# EAGLE design temperature_2 (EAGLE 9.6.2)
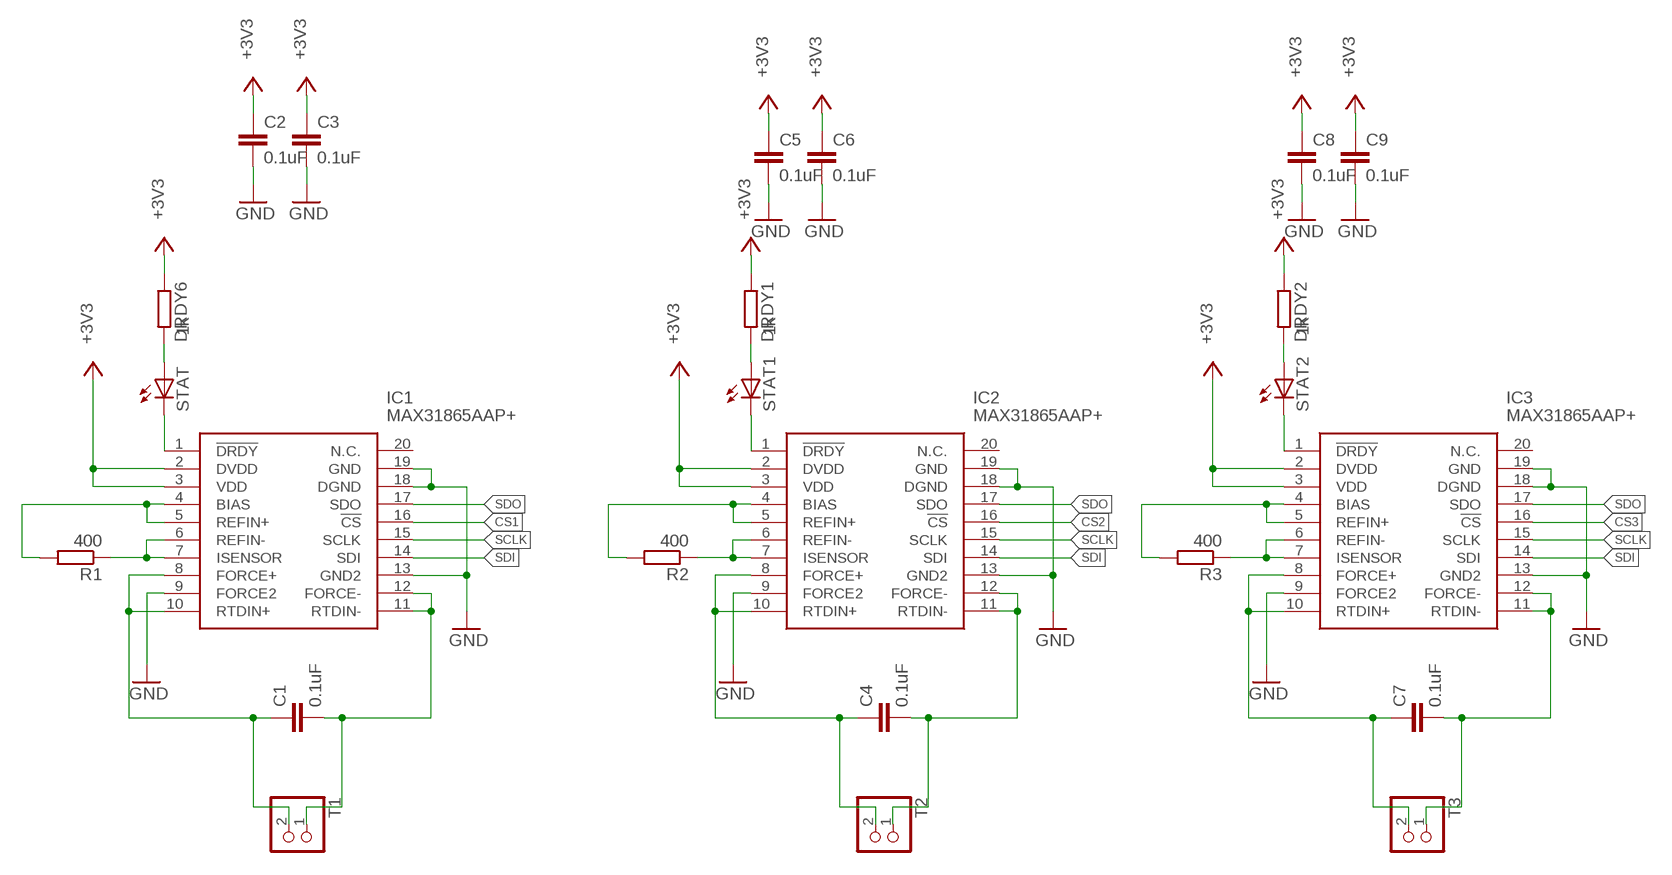
[diagram p0: schematic, sheet 1, part 1 of 2]
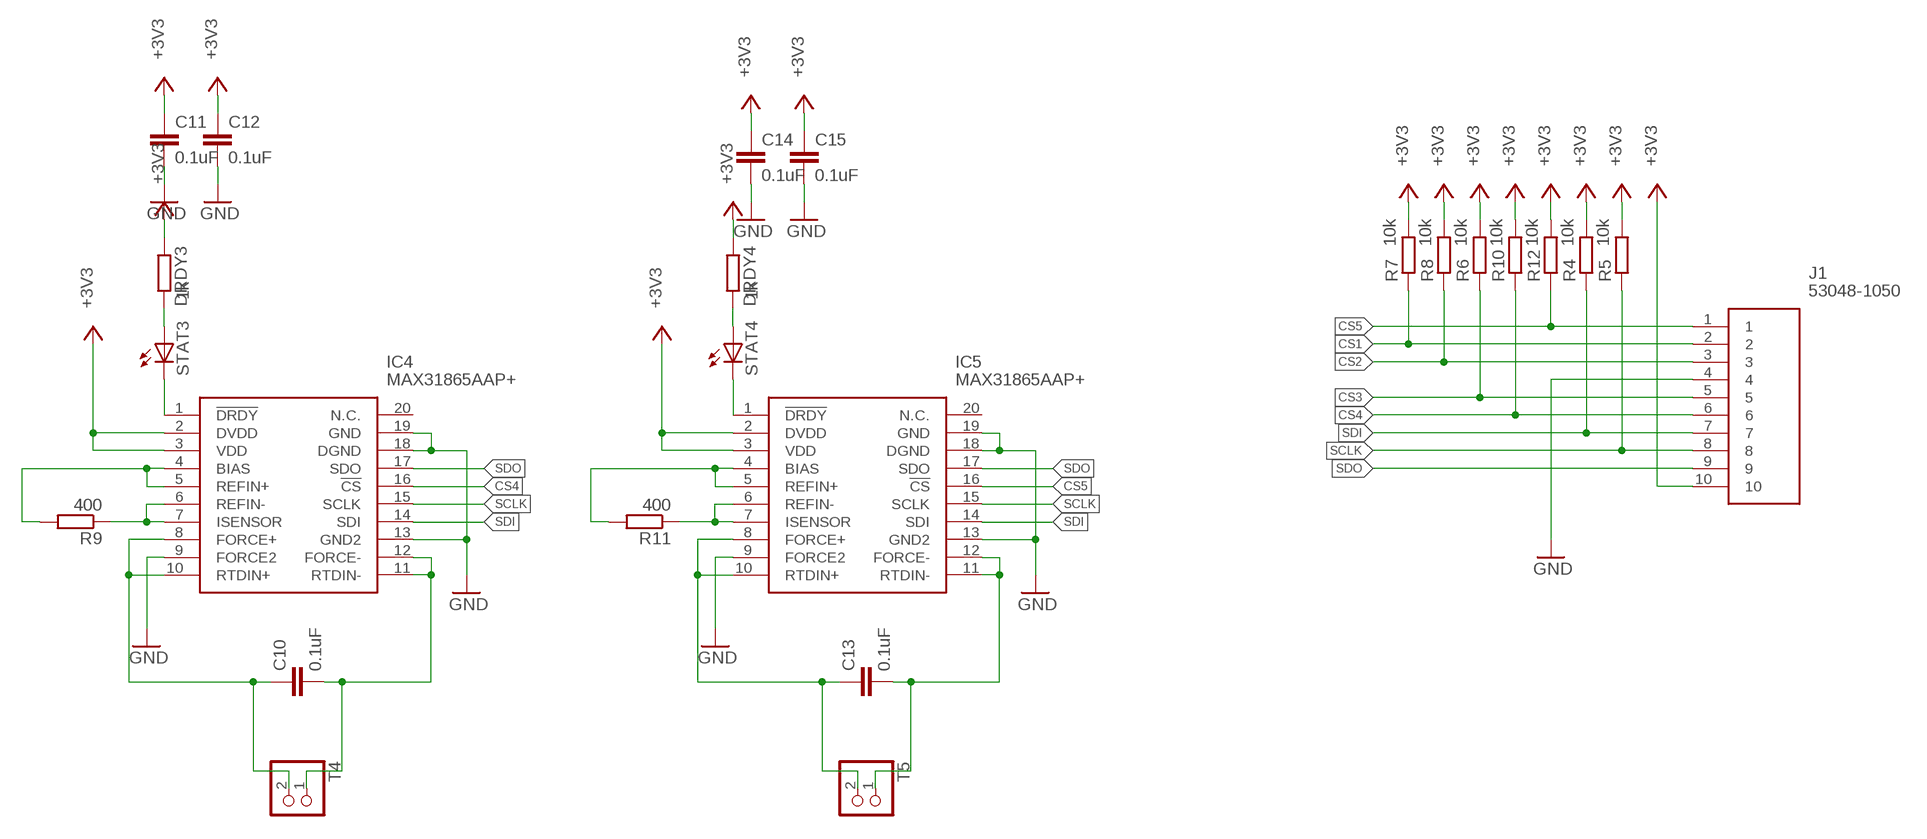
[diagram p1: schematic, sheet 1, part 2 of 2]

## Parts
C1  0.1uF  C-EUC0603K  [C0603K]
C2  0.1uF  C-EUC0603K  [C0603K]
C3  0.1uF  C-EUC0603K  [C0603K]
C4  0.1uF  C-EUC0603K  [C0603K]
C5  0.1uF  C-EUC0603K  [C0603K]
C6  0.1uF  C-EUC0603K  [C0603K]
C7  0.1uF  C-EUC0603K  [C0603K]
C8  0.1uF  C-EUC0603K  [C0603K]
C9  0.1uF  C-EUC0603K  [C0603K]
C10  0.1uF  C-EUC0603K  [C0603K]
C11  0.1uF  C-EUC0603K  [C0603K]
C12  0.1uF  C-EUC0603K  [C0603K]
C13  0.1uF  C-EUC0603K  [C0603K]
C14  0.1uF  C-EUC0603K  [C0603K]
C15  0.1uF  C-EUC0603K  [C0603K]
DRDY1  1k  R-EU_R0603  [R0603]
DRDY2  1k  R-EU_R0603  [R0603]
DRDY3  1k  R-EU_R0603  [R0603]
DRDY4  1k  R-EU_R0603  [R0603]
DRDY6  1k  R-EU_R0603  [R0603]
IC1  MAX31865AAP+  [SOP65P778X199-20N]
IC2  MAX31865AAP+  [SOP65P778X199-20N]
IC3  MAX31865AAP+  [SOP65P778X199-20N]
IC4  MAX31865AAP+  [SOP65P778X199-20N]
IC5  MAX31865AAP+  [SOP65P778X199-20N]
J1  53048-1050  [SHDRRA10W25P0X125_1X10_1425X55]
R1  400  R-EU_R1206  [R1206]
R2  400  R-EU_R1206  [R1206]
R3  400  R-EU_R1206  [R1206]
R4  10k  R-EU_R0603  [R0603]
R5  10k  R-EU_R0603  [R0603]
R6  10k  R-EU_R0603  [R0603]
R7  10k  R-EU_R0603  [R0603]
R8  10k  R-EU_R0603  [R0603]
R9  400  R-EU_R1206  [R1206]
R10  10k  R-EU_R0603  [R0603]
R11  400  R-EU_R1206  [R1206]
R12  10k  R-EU_R0603  [R0603]
STAT  LEDCHIPLED_0805  [CHIPLED_0805]
STAT1  LEDCHIPLED_0805  [CHIPLED_0805]
STAT2  LEDCHIPLED_0805  [CHIPLED_0805]
STAT3  LEDCHIPLED_0805  [CHIPLED_0805]
STAT4  LEDCHIPLED_0805  [CHIPLED_0805]
T1  PINHD-1X2  [1X02]
T2  PINHD-1X2  [1X02]
T3  PINHD-1X2  [1X02]
T4  PINHD-1X2  [1X02]
T5  PINHD-1X2  [1X02]

## Nets
+3V3: C2.1 C3.1 C5.1 C6.1 C8.1 C9.1 C11.1 C12.1 C14.1 C15.1 DRDY1.1 DRDY2.1 DRDY3.1 DRDY4.1 DRDY6.1 IC1.2(DVDD) IC1.3(VDD) IC2.2(DVDD) IC2.3(VDD) IC3.2(DVDD) IC3.3(VDD) IC4.2(DVDD) IC4.3(VDD) IC5.2(DVDD) IC5.3(VDD) J1.10 R4.2 R5.2 R6.2 R7.2 R8.2 R10.2 R12.2
CS1: IC1.16(!CS) J1.2 R7.1
CS2: IC2.16(!CS) J1.3 R8.1
CS3: IC3.16(!CS) J1.5 R6.1
CS4: IC4.16(!CS) J1.6 R10.1
CS5: IC5.16(!CS) J1.1 R12.1
GND: C2.2 C3.2 C5.2 C6.2 C8.2 C9.2 C11.2 C12.2 C14.2 C15.2 IC1.9(FORCE2) IC1.13(GND2) IC1.18(DGND) IC1.19(GND) IC2.9(FORCE2) IC2.13(GND2) IC2.18(DGND) IC2.19(GND) IC3.9(FORCE2) IC3.13(GND2) IC3.18(DGND) IC3.19(GND) IC4.9(FORCE2) IC4.13(GND2) IC4.18(DGND) IC4.19(GND) IC5.9(FORCE2) IC5.13(GND2) IC5.18(DGND) IC5.19(GND) J1.4
N$1: IC2.4(BIAS) IC2.5(REFIN+) R2.2
N$2: IC2.6(REFIN-) IC2.7(ISENSOR) R2.1
N$3: C4.1 IC2.8(FORCE+) IC2.10(RTDIN+) T2.2
N$4: C4.2 IC2.11(RTDIN-) IC2.12(FORCE-) T2.1
N$5: IC3.4(BIAS) IC3.5(REFIN+) R3.2
N$6: IC3.6(REFIN-) IC3.7(ISENSOR) R3.1
N$7: C7.1 IC3.8(FORCE+) IC3.10(RTDIN+) T3.2
N$8: C7.2 IC3.11(RTDIN-) IC3.12(FORCE-) T3.1
N$9: IC4.4(BIAS) IC4.5(REFIN+) R9.2
N$10: IC4.6(REFIN-) IC4.7(ISENSOR) R9.1
N$11: C10.1 IC4.8(FORCE+) IC4.10(RTDIN+) T4.2
N$12: C10.2 IC4.11(RTDIN-) IC4.12(FORCE-) T4.1
N$13: IC5.4(BIAS) IC5.5(REFIN+) R11.2
N$14: IC5.6(REFIN-) IC5.7(ISENSOR) R11.1
N$15: C13.1 IC5.8(FORCE+) IC5.10(RTDIN+) T5.2
N$16: C13.2 IC5.11(RTDIN-) IC5.12(FORCE-) T5.1
N$17: DRDY6.2 STAT.A
N$18: IC1.1(!DRDY) STAT.C
N$19: DRDY1.2 STAT1.A
N$20: IC2.1(!DRDY) STAT1.C
N$21: DRDY2.2 STAT2.A
N$22: IC1.4(BIAS) IC1.5(REFIN+) R1.2
N$23: IC1.6(REFIN-) IC1.7(ISENSOR) R1.1
N$24: IC3.1(!DRDY) STAT2.C
N$25: C1.1 IC1.8(FORCE+) IC1.10(RTDIN+) T1.2
N$26: C1.2 IC1.11(RTDIN-) IC1.12(FORCE-) T1.1
N$27: DRDY3.2 STAT3.A
N$28: IC4.1(!DRDY) STAT3.C
N$29: DRDY4.2 STAT4.A
N$30: IC5.1(!DRDY) STAT4.C
SCLK: IC1.15(SCLK) IC2.15(SCLK) IC3.15(SCLK) IC4.15(SCLK) IC5.15(SCLK) J1.8 R5.1
SDI: IC1.14(SDI) IC2.14(SDI) IC3.14(SDI) IC4.14(SDI) IC5.14(SDI) J1.7 R4.1
SDO: IC1.17(SDO) IC2.17(SDO) IC3.17(SDO) IC4.17(SDO) IC5.17(SDO) J1.9
Unconnected: IC1.20(N.C.) IC2.20(N.C.) IC3.20(N.C.) IC4.20(N.C.) IC5.20(N.C.)

## Library data of the parts
C1-C15 = rcl:C-EU: CAPACITOR, European symbol; SPICEPREFIX: C
DRDY1-DRDY4 DRDY6 R1-R12 = rcl:R-EU_: RESISTOR, European symbol; SPICEPREFIX: R
IC1-IC5 = MAX31865AAP+:MAX31865AAP+: Data Acquisition ADCs/DACs - Specialized RTD to Digital Converter in SSOP Source: Datasheet <https://componentsearchengine.com/Datasheets/1/MAX31865AAP .pdf>; DESCRIPTION: Data Acquisition ADCs/DACs - Specialized RTD to Digital Converter in SSOP; HEIGHT: 1.99mm; MANUFACTURER_NAME: Maxim Integrated; MANUFACTURER_PART_NUMBER: MAX31865AAP+; MOUSER_PART_NUMBER: 700-MAX31865AAP+; MOUSER_PRICE-STOCK: https://www.mouser.com/Search/Refine.aspx?Keyword=700-MAX31865AAP%2B; RS_PART_NUMBER: 1901435; RS_PRICE-STOCK: http://uk.rs-online.com/web/p/products/1901435
J1 = 53048-1050:53048-1050: 1.25mm Pitch, PicoBlade PCB Header, Single Row, Right-Angle, Through Hole, Gold (Au) Plating, Friction Lock, 4 Circuits, Tape and Reel, 2.30mm PC Tail Length Source: Datasheet <https://www.mouser.com/datasheet/2/276/0530481050_PCB_HEADERS-1532231.pdf>; DESCRIPTION: 1.25mm Pitch, PicoBlade PCB Header, Single Row, Right-Angle, Through Hole, Gold (Au) Plating, Friction Lock, 4 Circuits, Tape and Reel, 2.30mm PC Tail Length; HEIGHT: 3.5mm; MANUFACTURER_NAME: Molex; MANUFACTURER_PART_NUMBER: 53048-1050; MOUSER_PART_NUMBER: 538-53048-1050; MOUSER_PRICE-STOCK: https://www.mouser.co.uk/ProductDetail/Molex/53048-1050?qs=0lSvoLzn4L%252B50FRVV9pEsg%3D%3D
STAT STAT1-STAT4 = led:LED: LED OSRAM: - CHIPLED LG R971, LG N971, LY N971, LG Q971, LY Q971, LO R971, LY R971 LH N974, LH R974 LS Q976, LO Q976, LY Q976 LO Q996 - Hyper CHIPLED LW Q18S LB Q993, LB Q99A, LB R99A - SideLED LS A670, LO A670, LY A670, LG A670, LP A670 LB A673, LV A673, LT A673, LW A673 LH A674 LY A675 LS A676, LA A676, LO A676, LY A676, LW A676 LS A679, LY A679, LG A679 - Hyper Micro SIDELED® LS Y876, LA Y876, LO Y876, LY Y876 LT Y87S - SmartLED LW L88C, LW L88S LB L89C, LB L89S, LG L890 LS L89K, LO L89K, LY L89K LS L896, LA L896, LO L896, LY L896 - TOPLED LS T670, LO T670, LY T670, LG T670, LP T670 LSG T670, LSP T670, LSY T670, LOP T670, LYG T670 LG T671, LOG T671, LSG T671 LB T673, LV T673, LT T673, LW T673 LH T674 LS T676, LA T676, LO T676, LY T676, LB T676, LH T676, LSB T676, LW T676 LB T67C, LV T67C, LT T67C, LS T67K, LO T67K, LY T67K, LW E67C LS E67B, LA E67B, LO E67B, LY E67B, LB E67C, LV E67C, LT E67C LW T67C LS T679, LY T679, LG T679 LS T770, LO T770, LY T770, LG T770, LP T770 LB T773, LV T773, LT T773, LW T773 LH T774 LS E675, LA E675, LY E675, LS T675 LS T776, LA T776, LO T776, LY T776, LB T776 LHGB T686 LT T68C, LB T68C - Hyper Mini TOPLED® LB M676 - Mini TOPLED Santana® LG M470 LS M47K, LO M47K, LY M47K Source: http://www.osram.convergy.de LUXEON: - LUMILED® LXK2-PW12-R00, LXK2-PW12-S00, LXK2-PW14-U00, LXK2-PW14-V00 LXK2-PM12-R00, LXK2-PM12-S00, LXK2-PM14-U00 LXK2-PE12-Q00, LXK2-PE12-R00, LXK2-PE12-S00, LXK2-PE14-T00, LXK2-PE14-U00 LXK2-PB12-K00, LXK2-PB12-L00, LXK2-PB12-M00, LXK2-PB14-N00, LXK2-PB14-P00, LXK2-PB14-Q00 LXK2-PR12-L00, LXK2-PR12-M00, LXK2-PR14-Q00, LXK2-PR14-R00 LXK2-PD12-Q00, LXK2-PD12-R00, LXK2-PD12-S00 LXK2-PH12-R00, LXK2-PH12-S00 LXK2-PL12-P00, LXK2-PL12-Q00, LXK2-PL12-R00 Source: www.luxeon.com KINGBRIGHT: KA-3528ASYC Source: www.kingbright.com
T1-T5 = pinhead:PINHD-1X2: PIN HEADER

## Board
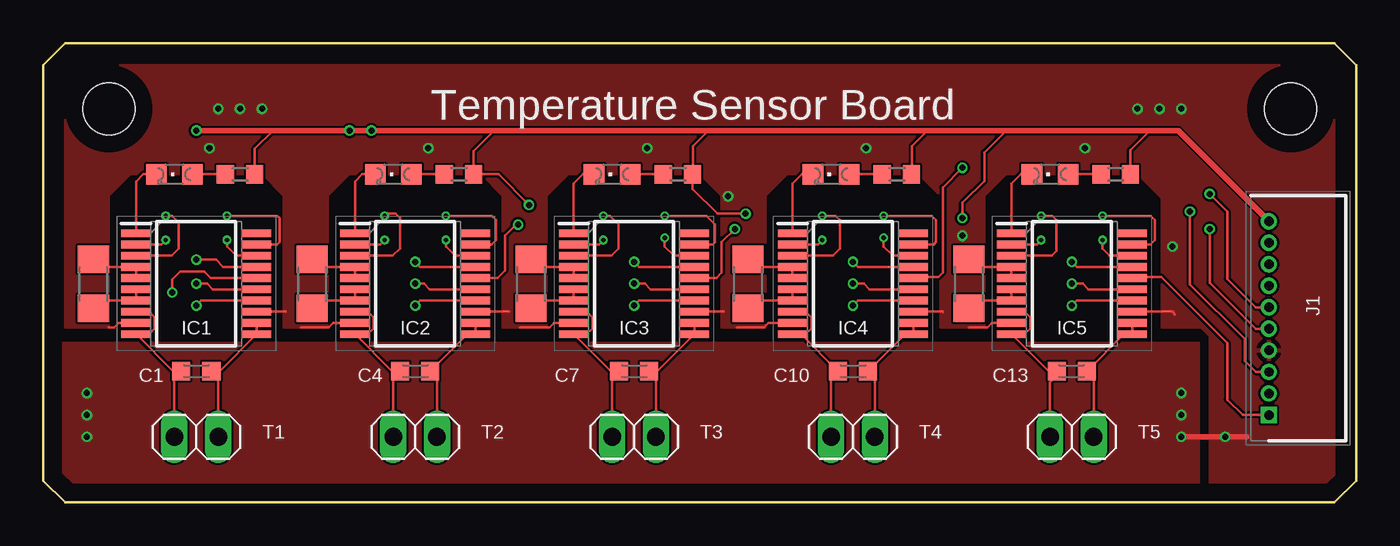
[diagram p2: board, top side]
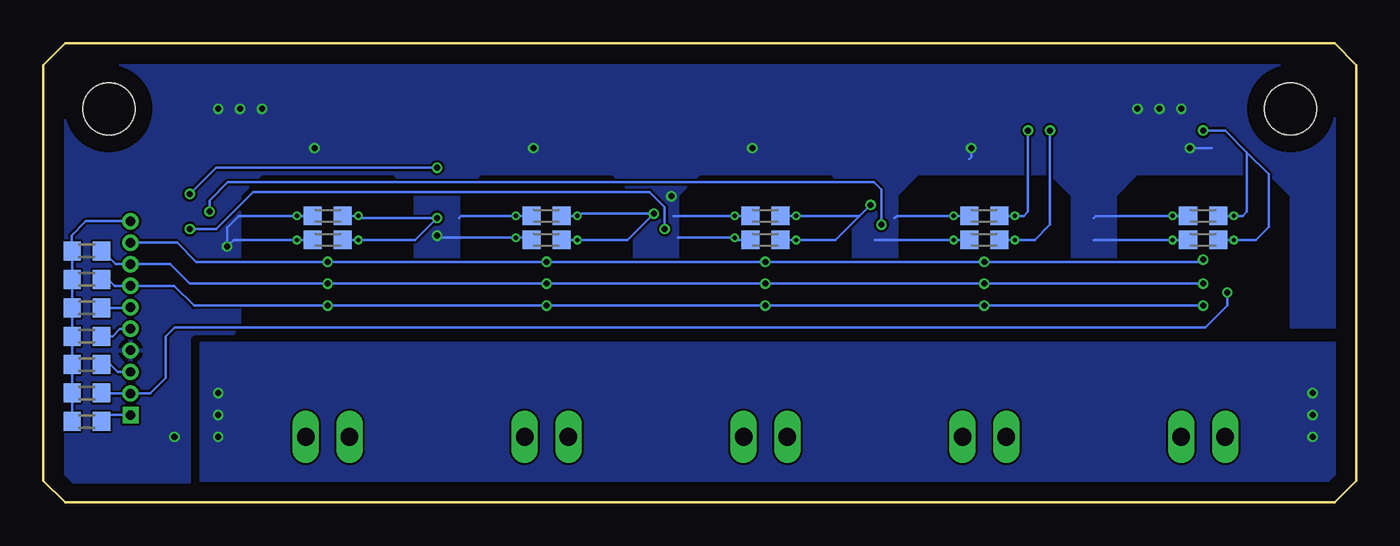
[diagram p3: board, bottom side, seen from below]

Size 76.2 x 26.67 mm. Coordinates in mm from the lower left corner, seen from the top.
Outline: 0,1.27 1.27,0 74.93,0 76.2,1.27 76.2,25.4 74.93,26.67 1.27,26.67 0,25.4 0,1.27
Copper layers (1*16): Top 0.035mm / dielectric 1.5mm / Bottom 0.035mm
Design rules "default *": minimum track width 6mil, minimum drill 0.2mm, track to track 5mil, track to pad 5mil, pad to pad 5mil, via to via 5mil, smd to smd 5mil, copper to edge 40mil, drill to drill 6mil, minimum pad ring 5mil, minimum via ring 5mil, stop-mask expansion 4mil, vias tented up to drill 0mil, thermal gap 10mil
Holes 3 mm at 3.81,22.86 72.39,22.86

### Footprints (pad centres in the part's own frame; a part is rotated, then mirrored left to right if it is on the bottom)
C0603K = smd 1.05 x 1.08: 1 -0.875,0; 2 0.875,0
R0603 = smd 1 x 1.1: 1 -0.85,0; 2 0.85,0
SOP65P778X199-20N = smd 1.705 x 0.45: 1 -3.498,2.925; 2 -3.498,2.275; 3 -3.498,1.625; 4 -3.498,0.975; 5 -3.498,0.325; 6 -3.498,-0.325; 7 -3.498,-0.975; 8 -3.498,-1.625; 9 -3.498,-2.275; 10 -3.498,-2.925; 11 3.498,-2.925; 12 3.498,-2.275; 13 3.498,-1.625; 14 3.498,-0.975; 15 3.498,-0.325; 16 3.498,0.325; 17 3.498,0.975; 18 3.498,1.625; 19 3.498,2.275; 20 3.498,2.925
SHDRRA10W25P0X125_1X10_1425X55 = drill 0.55 pad 0.95 square: 1 0,0 | drill 0.55 pad 0.95: 2 -1.25,0; 3 -2.5,0; 4 -3.75,0; 5 -5,0; 6 -6.25,0; 7 -7.5,0; 8 -8.75,0; 9 -10,0; 10 -11.25,0
R1206 = smd 1.6 x 1.803: 1 -1.422,0; 2 1.422,0
CHIPLED_0805 = smd 1.2 x 1.2: A 0,-1.05; C 0,1.05
1X02 = drill 1.016 long: 1 -1.27,0; 2 1.27,0

### Placement (x,y rotation side)
C1  8.89,7.62 0 top
C2  8.89,16.64 180 bottom
C3  8.89,15.24 180 bottom
C4  21.59,7.62 0 top
C5  21.59,16.64 180 bottom
C6  21.59,15.24 180 bottom
C7  34.29,7.62 0 top
C8  34.29,15.24 180 bottom
C9  34.29,16.64 180 bottom
C10  46.99,7.62 0 top
C11  46.99,16.64 180 bottom
C12  46.99,15.24 180 bottom
C13  59.69,7.62 0 top
C14  59.69,15.24 180 bottom
C15  59.69,16.64 180 bottom
DRDY1  24.13,19.05 180 top
DRDY2  36.83,19.05 180 top
DRDY3  49.53,19.05 180 top
DRDY4  62.23,19.05 180 top
DRDY6  11.43,19.05 180 top
IC1  8.89,12.7 0 top
IC2  21.59,12.7 0 top
IC3  34.29,12.7 0 top
IC4  46.99,12.7 0 top
IC5  59.69,12.7 0 top
J1  71.12,5.08 270 top
R1  2.92,12.7 90 top
R2  15.62,12.7 90 top
R3  28.32,12.7 90 top
R4  73.66,12.95 180 bottom
R5  73.66,14.61 180 bottom
R6  73.66,9.65 180 bottom
R7  73.66,6.35 180 bottom
R8  73.66,8 180 bottom
R9  40.89,12.7 90 top
R10  73.66,11.3 180 bottom
R11  53.72,12.7 90 top
R12  73.66,4.7 180 bottom
STAT  7.62,19.05 90 top
STAT1  20.32,19.05 90 top
STAT2  33.02,19.05 90 top
STAT3  45.72,19.05 90 top
STAT4  58.42,19.05 90 top
T1  8.89,3.81 180 top
T2  21.59,3.81 180 top
T3  34.29,3.81 180 top
T4  46.99,3.81 180 top
T5  59.69,3.81 180 top

### Tracks (layer width: path | path; a pad name or v marks a point on that pad's centre or on a via)
+3V3  (via drill 0.25, 0.35)
  Top 0.152: DRDY4.1 63.08,20.45 64.13,21.5 65.95,21.5 | 51.31,21.59 50.42,20.7 50.42,19.05 DRDY3.1 | 38.61,21.59 37.72,20.7 37.72,19.09 DRDY2.1 37.68,18.2 39.12,16.76 v40.77,16.76 | 26.16,21.59 24.98,20.41 DRDY1.1 26.42,19.05 v28.19,17.27 | DRDY6.1 12.28,20.54 13.33,21.59 | IC1.2 6.85,14.97 v7.11,15.24 | IC1.3 7.47,14.32 7.87,14.73 7.87,16.26 7.49,16.64 v7.11,16.64 | IC2.2 19.55,14.97 v19.81,15.24 | IC2.3 20.29,14.32 20.7,14.73 20.7,16.51 20.45,16.76 19.94,16.76 v19.81,16.64 | IC3.2 32.25,14.97 v32.51,15.24 | IC3.3 32.99,14.32 33.4,14.73 33.4,16.13 32.89,16.64 v32.51,16.64 | IC4.2 44.95,14.97 v45.21,15.24 | IC4.3 45.82,14.32 46.23,14.73 46.23,16.38 45.97,16.64 v45.21,16.64 | IC5.2 57.65,14.97 v57.91,15.24 | IC5.3 58.52,14.32 58.8,14.61 58.8,16.38 58.55,16.64 v57.91,16.64 | v53.34,16.51 53.34,17.4 54.61,18.67 54.61,20.32 55.88,21.59
  Top 0.305: v8.89,21.59 13.33,21.59 v17.78,21.59 v19.05,21.59 26.16,21.59 38.61,21.59 51.31,21.59 55.88,21.59 65.86,21.59 65.95,21.5 J1.10
  Bottom 0.152: R5.2 74.51,14.35 | 74.51,14.35 R4.2 | R4.2 R6.2 R8.2 R7.2 R12.2 | R10.2 R4.2 | J1.10 73.71,16.33 74.55,15.49 74.55,14.39 74.51,14.35 | C15.1 v57.91,16.64 57.78,16.51 v53.34,16.51 54.61,15.24 v57.91,15.24 C14.1 | C12.1 v45.21,15.24 42.29,15.24 v40.77,16.76 45.09,16.76 v45.21,16.64 C11.1 | C8.1 v32.51,15.24 30.23,15.24 28.83,16.64 | C9.1 v32.51,16.64 28.83,16.64 | C6.1 v19.81,15.24 18.67,15.24 17.78,16.13 v17.78,21.59 | C5.1 v19.81,16.64 19.3,16.64 19.05,16.89 v19.05,21.59 | C2.1 v7.11,16.64 6.6,16.64 6.35,16.89 6.35,20.32 | C3.1 v7.11,15.24 5.84,15.24 5.08,16 5.08,19.05 6.35,20.32 | 28.83,16.64 v28.19,17.27 | 6.35,20.32 7.62,21.59 v8.89,21.59
CS1  (via drill 0.35)
  Top 0.152: v7.49,12.19 7.49,12.95 7.95,13.41 9.34,13.41 9.72,13.03 IC1.16
  Bottom 0.152: R7.1 72.79,6.33 J1.2 69.98,6.33 69.09,7.22 69.09,9.63 68.56,10.16 8.76,10.16 7.49,11.43 v7.49,12.19
CS2  (via drill 0.35)
  Top 0.152: v27.56,16.13 27.43,16.13 26.8,15.49 26.8,13.46 26.36,13.03 IC2.16 | v66.55,16.89 66.55,12.66 69.72,9.48 69.72,8.21 70.36,7.58 J1.3
  Bottom 0.152: R8.1 72.3,8 71.88,7.58 J1.3 | v27.56,16.13 27.56,18.16 27.99,18.59 65.48,18.59 66.55,17.53 v66.55,16.89
CS3  (via drill 0.35)
  Top 0.152: IC3.16 39.06,13.03 39.37,13.34 39.37,15.11 v40.13,15.88 | v67.69,15.88 67.69,12.75 70.36,10.08 J1.5
  Bottom 0.152: R6.1 72.17,9.65 71.75,10.08 J1.5 | v40.13,15.88 40.13,17.14 41.02,18.03 64.01,18.03 66.17,15.88 v67.69,15.88
CS4  (via drill 0.35)
  Top 0.152: v67.69,17.91 68.71,16.89 68.71,12.98 70.36,11.33 J1.6 | IC4.16 50.56,13.09 51.94,13.09 52.2,13.35 52.2,18.29 v53.34,19.43
  Bottom 0.152: R10.1 71.15,11.3 J1.6 | v67.69,17.91 66.17,19.43 v53.34,19.43
CS5
  Top 0.152: J1.1 69.6,5.08 68.71,5.97 68.71,9.27 64.89,13.08 63.25,13.08 IC5.16
  Bottom 0.152: J1.1 72.43,5.08 R12.1
GND  (via drill 0.25, 0.35)
  Top 0.152: v10.67,15.24 10.67,14.86 11.2,14.32 IC1.18 | IC1.19 13.58,14.97 13.72,15.11 13.72,16.51 13.59,16.64 v10.67,16.64 | v23.37,15.24 23.37,14.86 23.9,14.32 IC2.18 | IC2.19 26.02,14.97 26.29,15.24 26.29,16.38 26.04,16.64 v23.37,16.64 | v36.07,15.37 36.07,14.86 36.6,14.32 IC3.18 | IC3.19 38.85,14.97 38.99,15.11 38.99,16.13 38.48,16.64 v36.07,16.64 | v48.77,15.37 48.77,14.86 49.3,14.32 IC4.18 | IC4.19 51.68,14.97 51.82,15.11 51.82,16.38 51.56,16.64 v48.77,16.64 | v61.47,15.24 61.47,14.73 61.88,14.32 IC5.18 | IC5.19 64.25,14.97 64.52,15.24 64.52,16.38 64.26,16.64 v61.47,16.64 | IC5.9 55.05,10.43 54.79,10.17 53.71,10.17 | IC5.13 65.51,11.07 65.66,10.92 | IC3.9 29.65,10.43 29.39,10.17 27.68,10.17 | IC2.13 27.03,11.07 | IC2.9 16.82,10.43 16.57,10.17 14.97,10.17 | IC1.13 14.07,11.07 | IC1.9 4.38,10.43 4.12,10.17 3.82,10.17 3.81,10.16 | IC4.9 42.09,10.43 41.84,10.17 40.25,10.17 | IC3.13 39.47,11.07 | IC4.13 52.17,11.07 52.2,11.05
  Top 0.305: v66.04,3.81 69.85,3.81
  Bottom 0.152: C14.2 v61.47,15.24 65.15,15.24 v65.53,14.86 65.53,15.95 64.85,16.64 v61.47,16.64 C15.2 | C12.2 47.99,15.37 v48.77,15.37 53.21,15.37 v53.34,15.49 | C11.2 v48.77,16.64 51.94,16.64 52.07,16.51 | C8.2 35.94,15.24 v36.07,15.37 39.37,15.37 | C9.2 v36.07,16.64 39.62,16.64 | C6.2 v23.37,15.24 27.94,15.24 | C5.2 v23.37,16.64 26.67,16.64 26.8,16.51 | C3.2 v10.67,15.24 15.24,15.24 | C2.2 v10.67,16.64 15.11,16.64 15.24,16.51 | 8.38,20.57 v9.65,20.57 | v22.35,20.57 22.35,20.04 22.46,19.93
  other vias: 66.04,6.35 66.04,5.08 2.54,3.81 2.54,5.08 2.54,6.35 10.16,22.86 12.7,22.86 11.43,22.86 63.5,22.86 64.77,22.86 66.04,22.86 35.05,20.57 47.75,20.57 60.45,20.57 68.58,3.81 39.75,17.78
  pour Bottom: 1.27,9.27 67.06,9.27 67.06,1.27 1.27,1.27
  pour Top: -1.27,9.27 67.06,9.27 67.06,-1.27 -1.27,-1.27
  pour Top: 67.69,9.65 67.18,10.16 64.9,10.16 64.9,17.65 63.5,19.05 55.88,19.05 54.61,17.78 54.61,10.16 52.07,10.16 52.07,17.78 50.8,19.05 43.18,19.05 41.91,17.78 41.91,10.16 39.37,10.16 39.37,17.78 38.1,19.05 30.48,19.05 29.21,17.78 29.21,10.16 26.67,10.16 26.67,17.78 25.4,19.05 17.78,19.05 16.51,17.78 16.51,10.16 13.97,10.16 13.97,17.78 12.7,19.05 5.08,19.05 3.81,17.78 3.81,10.16 1.27,10.16 1.27,25.4 74.93,25.4 74.93,0.89 67.69,1.02
  pour Bottom: 1.27,10.16 3.81,10.16 3.81,17.78 5.08,19.05 12.7,19.05 13.97,17.78 13.97,10.16 16.51,10.16 16.51,17.78 17.78,19.05 25.4,19.05 26.67,17.78 26.67,10.16 29.21,10.16 29.21,17.78 30.48,19.05 38.1,19.05 39.37,17.78 39.37,10.16 41.91,10.16 41.91,17.78 43.18,19.05 50.8,19.05 52.07,17.78 52.07,10.16 54.61,10.16 54.61,17.78 55.88,19.05 63.5,19.05 64.77,17.78 64.77,16.51 64.77,10.16 65.15,9.78 65.41,9.78 67.44,9.78 67.69,9.53 67.69,1.14 74.8,1.14 74.93,1.27 74.93,25.4 1.27,25.4
N$1
  Top 0.152: R2.2 15.75,13.68 IC2.4 IC2.5
N$2
  Top 0.152: IC2.6 IC2.7 15.75,11.72 R2.1
N$3
  Top 0.152: IC2.8 18.84,11.07 19.17,10.74 19.17,10.11 18.84,9.78 IC2.10 20.25,7.62 C4.1 20.32,7.22 T2.2
N$4
  Top 0.152: IC2.12 IC2.11 24.62,9.78 C4.2 22.86,7.22 T2.1
N$5
  Top 0.152: IC3.5 IC3.4 28.45,13.68 R3.2
N$6
  Top 0.152: IC3.6 IC3.7 28.45,11.72 R3.1
N$7
  Top 0.152: IC3.8 31.54,11.07 31.87,10.74 31.87,10.11 31.54,9.78 IC3.10 32.95,7.62 C7.1 33.02,7.22 T3.2
N$8
  Top 0.152: IC3.12 IC3.11 35.63,7.62 C7.2 35.56,7.22 T3.1
N$9
  Top 0.152: R9.2 41.02,13.68 IC4.4 IC4.5
N$10
  Top 0.152: IC4.6 IC4.7 41.02,11.72 R9.1
N$11
  Top 0.152: IC4.8 44.24,11.07 44.57,10.74 44.57,10.11 44.24,9.78 IC4.10 43.96,9.78 C10.1 46.11,7.51 45.72,7.11 T4.2
N$12
  Top 0.152: IC4.12 IC4.11 50.02,9.78 C10.2 47.86,7.51 48.26,7.11 T4.1
N$13
  Top 0.152: IC5.5 IC5.4 53.85,13.68 R11.2
N$14
  Top 0.152: IC5.6 IC5.7 53.85,11.72 R11.1
N$15
  Top 0.152: IC5.8 56.94,11.07 57.27,10.74 57.27,10.11 56.94,9.78 IC5.10 58.35,7.62 C13.1 58.81,7.38 58.42,6.99 T5.2
N$16
  Top 0.152: IC5.12 IC5.11 62.72,9.78 C13.2 60.96,7.22 T5.1
N$17
  Top 0.152: DRDY6.2 STAT.A
N$18
  Top 0.152: STAT.C 5.81,19.05 5.39,18.63 IC1.1
N$19
  Top 0.152: DRDY1.2 STAT1.A
N$20
  Top 0.152: STAT1.C 18.51,19.05 18.09,18.63 IC2.1
N$21
  Top 0.152: DRDY2.2 STAT2.A
N$22
  Top 0.152: IC1.5 IC1.4 3.05,13.68 R1.2
N$23
  Top 0.152: IC1.6 IC1.7 3.05,11.72 R1.1
N$24
  Top 0.152: STAT2.C 31.34,19.05 30.79,18.51 IC3.1
N$25
  Top 0.152: IC1.8 6.14,11.07 6.47,10.74 6.47,10.11 6.14,9.78 IC1.10 7.55,7.62 C1.1 7.62,7.22 T1.2
N$26
  Top 0.152: IC1.12 IC1.11 10.23,7.62 C1.2 10.16,7.22 T1.1
N$27
  Top 0.152: DRDY3.2 STAT3.A
N$28
  Top 0.152: STAT3.C 44.03,19.05 43.49,18.51 IC4.1
N$29
  Top 0.152: DRDY4.2 STAT4.A
N$30
  Top 0.152: STAT4.C 56.73,19.05 56.19,18.51 IC5.1
SCLK  (via drill 0.35)
  Top 0.152: IC1.15 9.85,12.38 9.53,12.7 v8.89,12.7 | IC2.15 22.42,12.38 22.1,12.7 v21.59,12.7 | IC3.15 35.25,12.38 34.92,12.7 v34.29,12.7 | IC4.15 47.95,12.38 47.62,12.7 v46.99,12.7 | IC5.15 60.65,12.38 60.33,12.7 v59.69,12.7
  Bottom 0.152: R5.1 72.77,14.61 72,13.83 J1.8 68.82,13.83 67.69,12.7 v59.69,12.7 v46.99,12.7 v34.29,12.7 v21.59,12.7 v8.89,12.7
SDI  (via drill 0.35)
  Top 0.152: IC1.14 9.18,11.72 v8.89,11.43 | IC2.14 21.89,11.72 v21.59,11.43 | IC3.14 34.59,11.72 v34.29,11.43 | IC4.14 47.28,11.72 v46.99,11.43 | IC5.14 59.98,11.72 v59.69,11.43
  Bottom 0.152: R4.1 72.43,12.95 72.05,12.58 J1.7 68.58,12.57 67.44,11.43 v59.69,11.43 v46.99,11.43 v34.29,11.43 v21.59,11.43 v8.89,11.43
SDO  (via drill 0.35)
  Top 0.152: IC1.17 10.46,13.68 10.03,14.1 v8.89,14.1 | IC2.17 21.89,13.68 v21.59,13.97 | IC3.17 34.59,13.68 v34.29,13.97 | IC4.17 47.28,13.68 v46.99,13.97 | IC5.17 59.98,13.68 v59.69,13.97
  Bottom 0.152: J1.9 68.42,15.08 67.31,13.97 v59.69,13.97 v46.99,13.97 v34.29,13.97 v21.59,13.97 8.89,13.97 v8.89,14.1

### Text on the board
tNames: Temperature Sensor Board